# Altium schematic sheet LED_Control.SchDoc
size A4; Organization: Altium Limited; Address1: 3 Minna Close; Address2: Belrose; Address3: NSW 2086; Address4: Australia
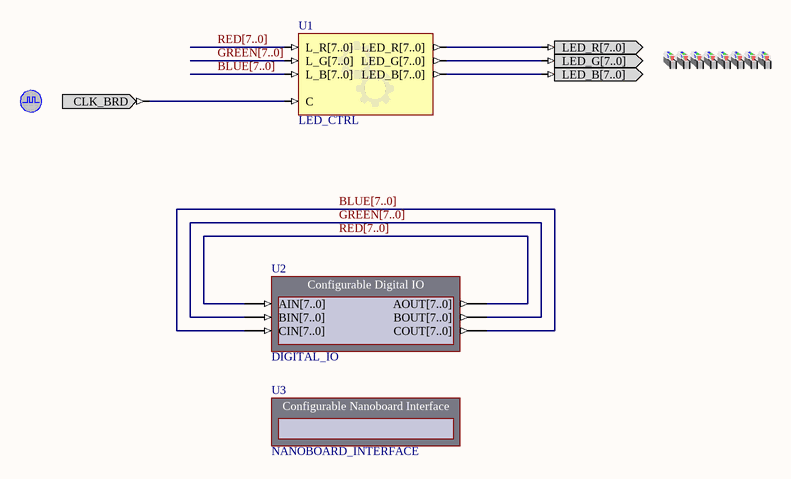
[diagram p0: LED_Control.SchDoc]

## Parts
(Parts that share a designator on the sheet are numbered #1, #2 ... from top to bottom, then left to right.)
?#1  LEDS_RGB  (value not drawn)
?#2  CLOCK_BOARD  (value not drawn)
U1  LED_CTRL
U2  DIGITAL_IO
U3  NANOBOARD_INTERFACE

## Nets
BLUE[7..0]: U1.L_B[7..0] U2.CIN[7..0] U2.COUT[7..0]
GREEN[7..0]: U1.L_G[7..0] U2.BIN[7..0] U2.BOUT[7..0]
RED[7..0]: U1.L_R[7..0] U2.AIN[7..0] U2.AOUT[7..0]
Net?#1_LED_B[7..0]: ?#1.LED_B[7..0] U1.LED_B[7..0]
Net?#1_LED_G[7..0]: ?#1.LED_G[7..0] U1.LED_G[7..0]
Net?#1_LED_R[7..0]: ?#1.LED_R[7..0] U1.LED_R[7..0]
Net?#2_CLK_BRD: ?#2.CLK_BRD U1.C

## Buses and harness runs
bus BLUE[7..0]
bus GREEN[7..0]
bus RED[7..0]

## Notes on the sheet
- Title
- Size:
- Date:
- A4
- Number:
- Time:
- Revision:
- Sheet
- of
- File:

## Library data of the parts
?#1 = LEDS_RGB: LEDS RGB; PortComponent: True; Published: 11-Mar-2009; Publisher: Altium Limited
?#2 = CLOCK_BOARD: Global System Clock Supply; PortComponent: True; Published: 19-Nov-2003; Publisher: Altium Limited; HelpURL: TR0143 Technical Reference Manual for Altium's Desktop NanoBoard NB2DSK01.pdf#page=41; UseInDSF: True
U1 = LED_CTRL: Configurable LED Controller; ConfigurationParameters: {}Version[1.0]{}NumLEDs[8]{}IntensityControl[Global]{}ConstantIntensity[10]{}BusEnOut[True]{}IsRGB[True]{}; LastRevisionNo: 1.00.00; Published: 27-Apr-2009; Publisher: Altium Limited; ConfiguratorName: LED_CTRL
U2 = DIGITAL_IO: Configurable Digital IO; NEXUS_CORE: Instrument; NEXUS_JTAG_DEVICE: True; NEXUS_JTAG_ORDER: 0; ConfigurationParameters: {}Version[2.0]{}StorageType[3]{}InterfaceType[Parallel]{}SchCompWidth[140]{}Input0Name[AIN{1}7..0{2}]{}Input0Width[8]{}Input0InitValue[0]{}Input0Kind[LED Digits]{}Input0SegStyle[Red]{}Input0SegRadix[Binary]{}Input1Name[BIN{1}7..0{2}]{}Input1Width[8]{}Input1InitValue[0]{}Input1Kind[LED Digits]{}Input1SegStyle[Green]{}Input1SegRadix[Binary]{}Input2Name[CIN{1}7..0{2}]{}Input2Width[8]{}Input2InitValue[0]{}Input2Kind[LED Digits]{}Input2SegStyle[Black]{}Input2SegRadix[Binary]{}Output0Name[AOUT{1}7..0{2}]{}Output0Width[8]{}Output0InitValue[0]{}Output0Kind[Slider]{}Output1Name[BOUT{1}7..0{2}]{}Output1Width[8]{}Output1InitValue[0]{}Output1Kind[Slider]{}Output2Name[COUT{1}7..0{2}]{}Output2Width[8]{}Output2InitValue[0]{}Output2Kind[Slider]{}Designator[U2]{}InternalID[0]{}; ConfiguratorName: DIGITAL_IO; ComponentLink1Description: Core &Resource Usage; ComponentLink1URL: CR0134 FPGA Instrument Resource Usage.pdf; Core Revision: 1.00.00; HelpURL: CR0179 DIGITAL_IO Configurable Digital IO Module.pdf; LastRevisionNo: 1.00.00; Published: 28-Jun-2007; Publisher: Altium Limited; UseInDSF: True
U3 = NANOBOARD_INTERFACE: Configurable Nanoboard Interface; NEXUS_CORE: Instrument; NEXUS_JTAG_DEVICE: True; NEXUS_JTAG_ORDER: 0; ConfiguratorName: DIGITAL_IO_APPLICATION; ConfigurationParameters: {}Version[1.0]{}StorageType[0]{}SubProjectPath[Controller.PrjScr]{}ID[{6C6BF2B6-53A0-46FB-9E70-7E22AC90BD14}]{}DisabledInDashboard[False]{}AutoRun[False]{}; ComponentLink1Description: Core &Resource Usage; ComponentLink1URL: CR0134 FPGA Instrument Resource Usage.pdf; Core Revision: 1.00.00; HelpURL: https://wiki.altium.com/display/ADOH/Connected+FPGA+Scripts; LastRevisionNo: 1.00.00; Published: 06-May-2009; Publisher: Altium Limited